# Altium project shm.PrjPcb (part 2 of 2)

## Sheet mcu_v1.SchDoc
size A2; SheetNumber: 4; SheetTotal: 4
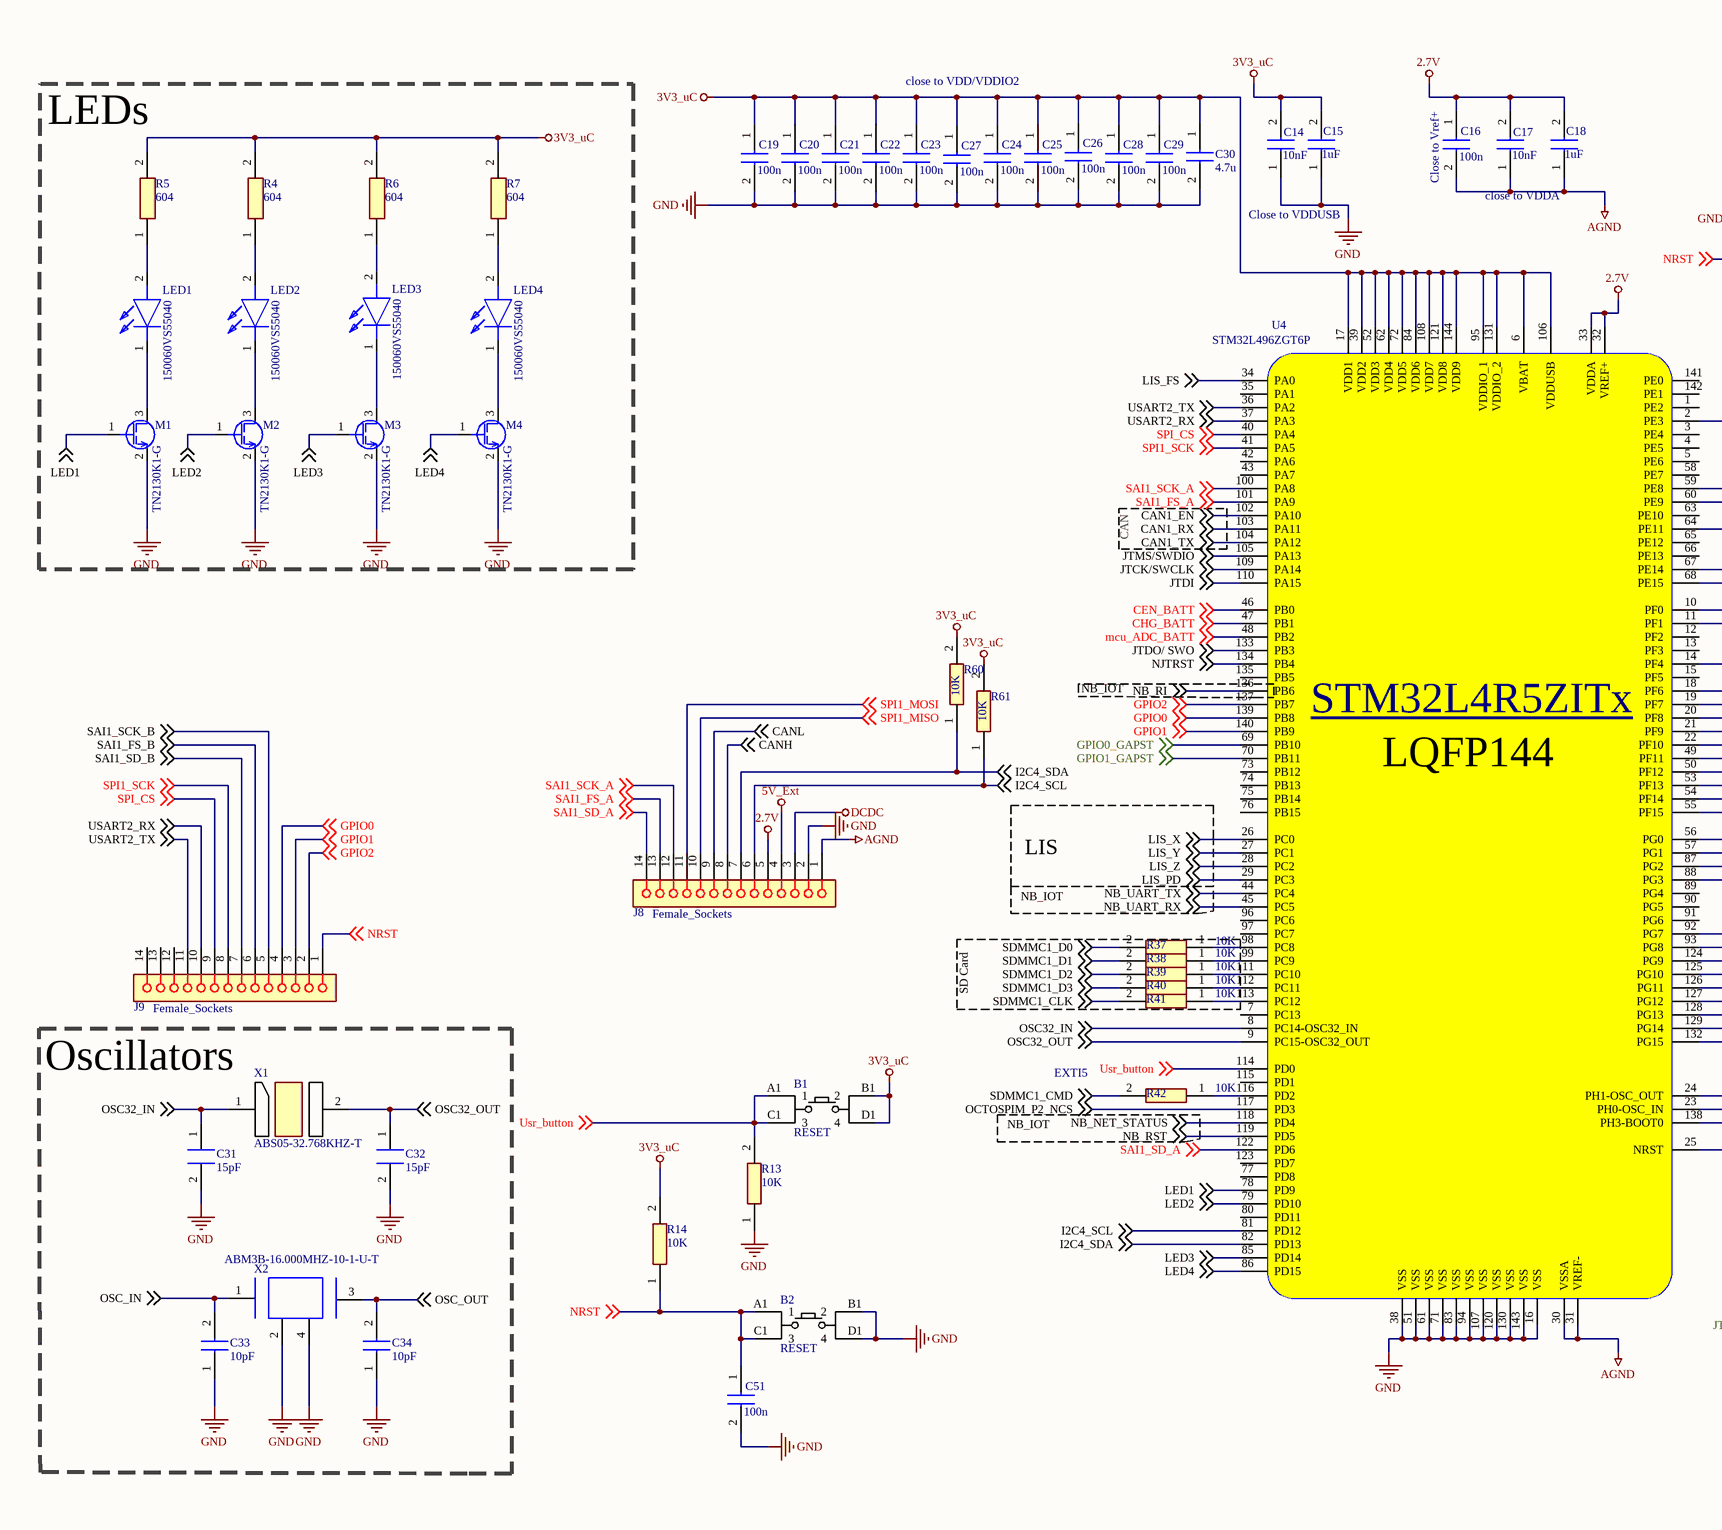
[diagram p3: mcu_v1.SchDoc, left]
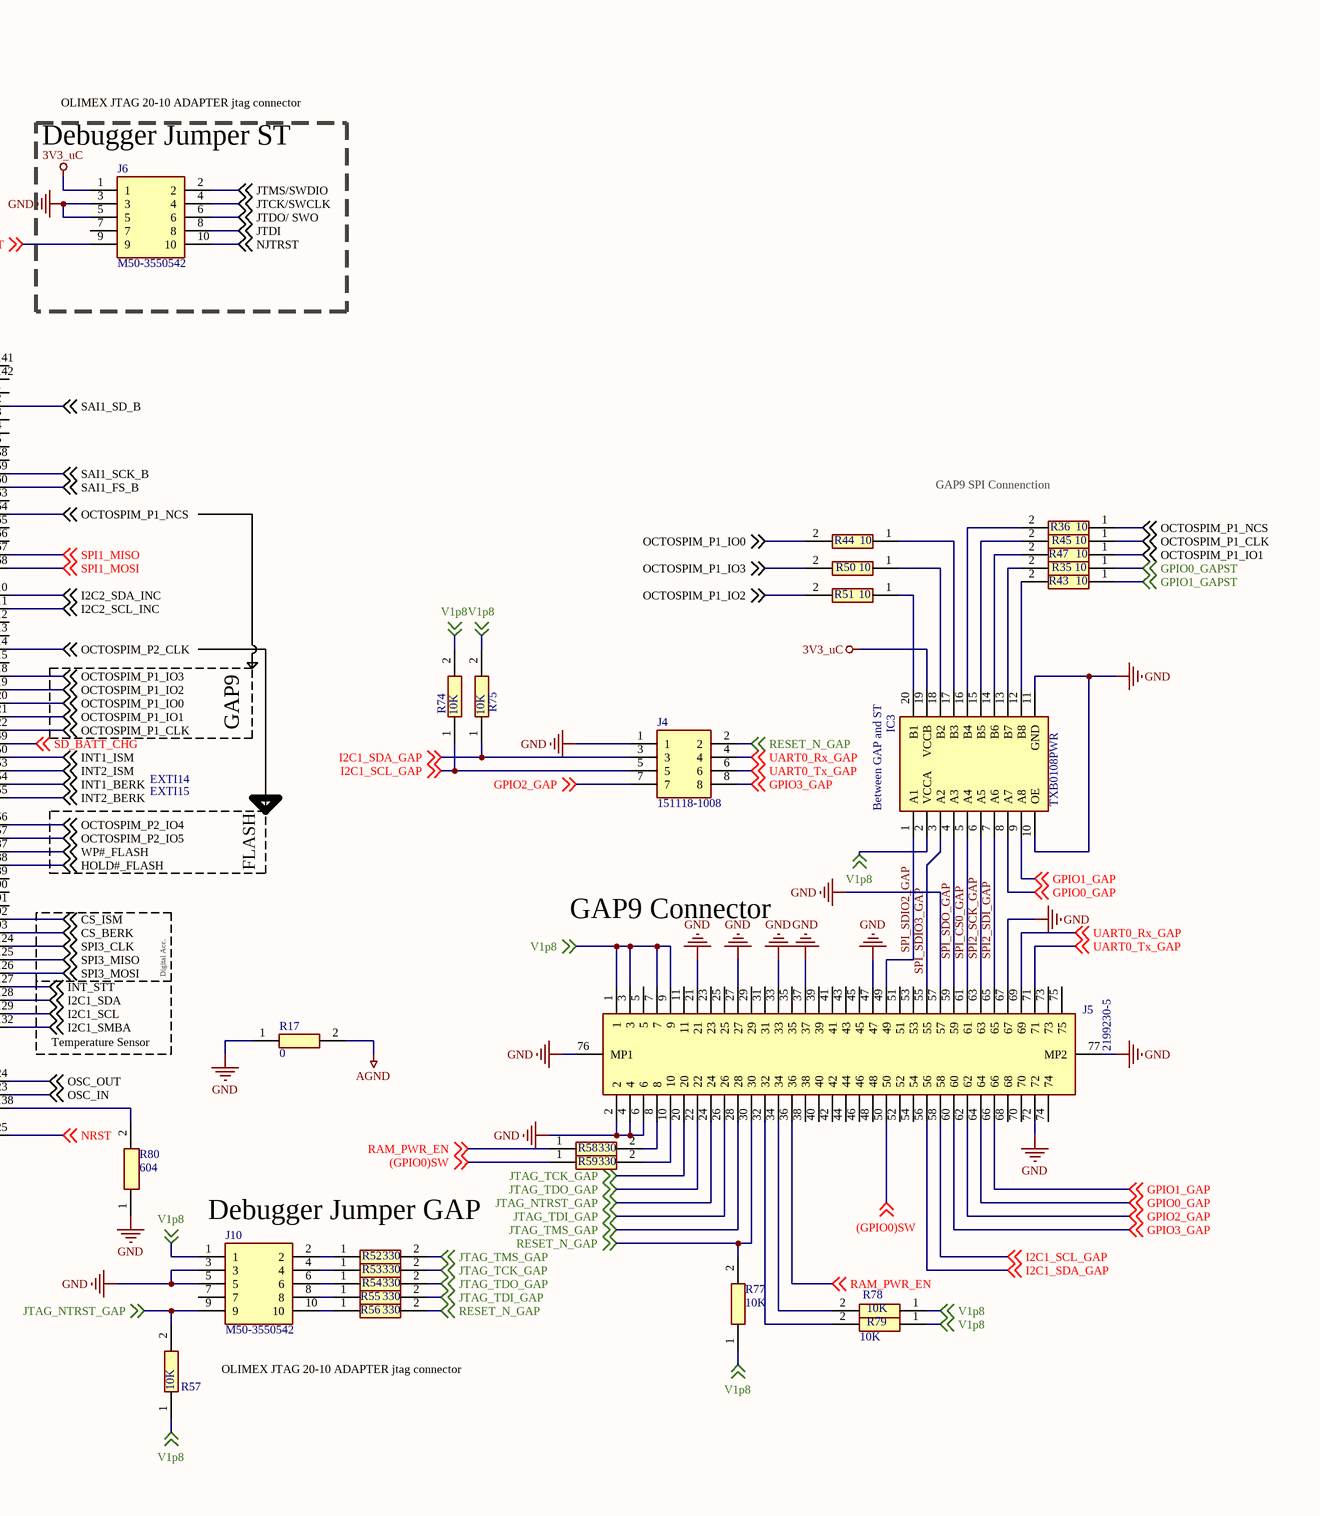
[diagram p4: mcu_v1.SchDoc, right]

### Parts
B1  RESET  [PTS645SM43JSMTR92LFS]
B2  RESET  [PTS645SM43JSMTR92LFS]
C14  10nF  [CAPC1608X87N]
C15  1uF  [CAPC2012X100N]
C16  100n  [CAPC1608X87N]
C17  10nF  [CAPC1608X87N]
C18  1uF  [CAPC2012X100N]
C19  100n  [CAPC1608X87N]
C20  100n  [CAPC1608X87N]
C21  100n  [CAPC1608X87N]
C22  100n  [CAPC1608X87N]
C23  100n  [CAPC1608X87N]
C24  100n  [CAPC1608X87N]
C25  100n  [CAPC1608X87N]
C26  100n  [CAPC1608X87N]
C27  100n  [CAPC1608X87N]
C28  100n  [CAPC1608X87N]
C29  100n  [CAPC1608X87N]
C30  4.7u  [CAPC3216X100N]
C31  15pF  [CAPC1608X87N]
C32  15pF  [CAPC1608X87N]
C33  10pF  [CAPC1608X87N]
C34  10pF  [CAPC1608X87N]
C51  100n  [CAPC1608X87N]
IC3  TXB0108PWR  [SOP65P640X120-20N]
J4  151118-1008  [1511181008]
J5  2199230-5  [21992305]
J6  M50-3550542  [SHDR10W40P127_2X5_2083X565X1160P]
J8  Female_Sockets  [BCS-114-XXX-S-TE]
J9  Female_Sockets  [BCS-114-XXX-S-TE]
J10  M50-3550542  [SHDR10W40P127_2X5_2083X565X1160P]
LED1  150060VS55040  [LEDM168X50N]
LED2  150060VS55040  [LEDM168X50N]
LED3  150060VS55040  [LEDM168X50N]
LED4  150060VS55040  [LEDM168X50N]
M1  TN2130K1-G  [SOT95P237X112-3N]
M2  TN2130K1-G  [SOT95P237X112-3N]
M3  TN2130K1-G  [SOT95P237X112-3N]
M4  TN2130K1-G  [SOT95P237X112-3N]
R4  604  [RESC1608X55N]
R5  604  [RESC1608X55N]
R6  604  [RESC1608X55N]
R7  604  [RESC1608X55N]
R13  10K  [ERJ3EK_(0603)]
R14  10K  [RESC1608X55N]
R17  0  [RESC1608X55N]
R35  10  [RESC1005X40N]
R36  10  [RESC1005X40N]
R37  10K  [ERJ3EK_(0603)]
R38  10K  [ERJ3EK_(0603)]
R39  10K  [ERJ3EK_(0603)]
R40  10K  [ERJ3EK_(0603)]
R41  10K  [ERJ3EK_(0603)]
R42  10K  [ERJ3EK_(0603)]
R43  10  [RESC1005X40N]
R44  10  [RESC1005X40N]
R45  10  [RESC1005X40N]
R47  10  [RESC1005X40N]
R50  10  [RESC1005X40N]
R51  10  [RESC1005X40N]
R52  330  [RESC3216X51N]
R53  330  [RESC3216X51N]
R54  330  [RESC3216X51N]
R55  330  [RESC3216X51N]
R56  330  [RESC3216X51N]
R57  10K  [ERJ3EK_(0603)]
R58  330  [RESC3216X51N]
R59  330  [RESC3216X51N]
R60  10K  [ERJP14_(1210)]
R61  10K  [ERJP14_(1210)]
R74  10K  [ERJ3EK_(0603)]
R75  10K  [ERJ3EK_(0603)]
R77  10K  [ERJP14_(1210)]
R78  10K  [ERJ3EK_(0603)]
R79  10K  [ERJ3EK_(0603)]
R80  604  [RESC1608X55N]
U4  STM32L496ZGT6P  [QFP50P2200X2200X160-144N]
X1  ABS05-32.768KHZ-T  [ABS0532768KHZT]
X2  ABM3B-16.000MHZ-10-1-U-T  [OSCCC500X320X110-4N]

### Blocks framed on the sheet
LEDs: LED1-LED4 M1-M4 R4-R7
Debugger Jumper ST: J6
SD Card: R37-R41
Oscillators: C31-C34 X1 X2

### Nets
2.7V: C16.1 C17.2 C18.2 J8.5 U4.32(VREF+) U4.33(VDDA)
3V3_uC: B1.B1(2) B1.D1(4) C14.2 C15.2 C19.1 C20.1 C21.1 C22.1 C23.1 C24.1 C25.1 C26.1 C27.1 C28.1 C29.1 C30.1 IC3.19(VCCB) J6.1 R4.2 R5.2 R6.2 R7.2 R14.2 R60.2 R61.2 U4.6(VBAT) U4.17(VDD1) U4.39(VDD2) U4.52(VDD3) U4.62(VDD4) U4.72(VDD5) U4.84(VDD6) U4.95(VDDIO_1) U4.106(VDDUSB) U4.108(VDD7) U4.121(VDD8) U4.131(VDDIO_2) U4.144(VDD9)
5V_Ext: J8.4
AGND: C16.2 C17.1 C18.1 J8.1 R17.2 U4.30(VSSA) U4.31(VREF-)
DCDC: J8.3
GND: B2.B1(2) B2.D1(4) C14.1 C15.1 C19.2 C20.2 C21.2 C22.2 C23.2 C24.2 C25.2 C26.2 C27.2 C28.2 C29.2 C30.2 C31.2 C32.2 C33.1 C34.1 C51.2 IC3.10(OE) IC3.11(GND) J4.1 J5.2 J5.4 J5.6 J5.21 J5.27 J5.33 J5.37 J5.47 J5.57 J5.67 J5.72 J5.76(MP1) J5.77(MP2) J6.3 J6.5 J8.2 J10.3 J10.5 M1.2(S) M2.2(S) M3.2(S) M4.2(S) R13.1 R17.1 R80.1 U4.16(VSS) U4.38(VSS) U4.51(VSS) U4.61(VSS) U4.71(VSS) U4.83(VSS) U4.94(VSS) U4.107(VSS) U4.120(VSS) U4.130(VSS) U4.143(VSS) X2.2 X2.4
(GPIO0)SW: J5.50 R59.1 ; off-sheet (GPIO0)SW
CAN1_EN: U4.102(PA10) ; off-sheet CAN1_EN
CAN1_RX: U4.103(PA11) ; off-sheet CAN1_RX
CAN1_TX: U4.104(PA12) ; off-sheet CAN1_TX
CANH: J8.8 ; off-sheet CANH
CANL: J8.9 ; off-sheet CANL
CEN_BATT: U4.46(PB0) ; off-sheet CEN_BATT
CHG_BATT: U4.47(PB1) ; off-sheet CHG_BATT
CS_BERK: U4.93(PG8) ; off-sheet CS_BERK
CS_ISM: U4.92(PG7) ; off-sheet CS_ISM
GPIO0: J9.4 U4.139(PB8) ; off-sheet GPIO0
GPIO0_GAP: IC3.8(A7) J5.64 ; off-sheet GPIO0_GAP
GPIO0_GAPST: R35.1 U4.69(PB10) ; off-sheet GPIO0_GAPST
GPIO1: J9.3 U4.140(PB9) ; off-sheet GPIO1
GPIO1_GAP: IC3.9(A8) J5.66 ; off-sheet GPIO1_GAP
GPIO1_GAPST: R43.1 U4.70(PB11) ; off-sheet GPIO1_GAPST
GPIO2: J9.2 U4.137(PB7) ; off-sheet GPIO2
GPIO2_GAP: J4.7 J5.62 ; off-sheet GPIO2_GAP
GPIO3_GAP: J4.8 J5.60 ; off-sheet GPIO3_GAP
HOLD#_FLASH: U4.88(PG3) ; off-sheet HOLD#_FLASH
I2C1_SCL: U4.129(PG14) ; off-sheet I2C1_SCL
I2C1_SCL_GAP: J4.5 J5.58 R74.1 ; off-sheet I2C1_SCL_GAP
I2C1_SDA: U4.128(PG13) ; off-sheet I2C1_SDA
I2C1_SDA_GAP: J4.3 J5.56 R75.1 ; off-sheet I2C1_SDA_GAP
I2C1_SMBA: U4.132(PG15) ; off-sheet I2C1_SMBA
I2C2_SCL_INC: U4.11(PF1) ; off-sheet I2C2_SCL_INC
I2C2_SDA_INC: U4.10(PF0) ; off-sheet I2C2_SDA_INC
I2C4_SCL: J8.6 R61.1 U4.81(PD12) ; off-sheet I2C4_SCL
I2C4_SDA: J8.7 R60.1 U4.82(PD13) ; off-sheet I2C4_SDA
INT1_BERK: U4.54(PF14) ; off-sheet INT1_BERK
INT1_ISM: U4.50(PF12) ; off-sheet INT1_ISM
INT2_BERK: U4.55(PF15) ; off-sheet INT2_BERK
INT2_ISM: U4.53(PF13) ; off-sheet INT2_ISM
INT_STT: U4.127(PG12) ; off-sheet INT_STT
JTAG_NTRST_GAP: J5.24 J10.9 R57.2 ; off-sheet JTAG_NTRST_GAP
JTAG_TCK_GAP: J5.20 R53.2 ; off-sheet JTAG_TCK_GAP
JTAG_TDI_GAP: J5.26 R55.2 ; off-sheet JTAG_TDI_GAP
JTAG_TDO_GAP: J5.22 R54.2 ; off-sheet JTAG_TDO_GAP
JTAG_TMS_GAP: J5.28 R52.2 ; off-sheet JTAG_TMS_GAP
JTCK/SWCLK: J6.4 U4.109(PA14) ; off-sheet JTCK/SWCLK
JTDI: J6.8 U4.110(PA15) ; off-sheet JTDI
JTDO/ SWO: J6.6 U4.133(PB3) ; off-sheet JTDO/ SWO
JTMS/SWDIO: J6.2 U4.105(PA13) ; off-sheet JTMS/SWDIO
LED1: M1.1(G) U4.78(PD9) ; off-sheet LED1
LED2: M2.1(G) U4.79(PD10) ; off-sheet LED2
LED3: M3.1(G) U4.85(PD14) ; off-sheet LED3
LED4: M4.1(G) U4.86(PD15) ; off-sheet LED4
LIS_FS: U4.34(PA0) ; off-sheet LIS_FS
LIS_PD: U4.29(PC3) ; off-sheet LIS_PD
LIS_X: U4.26(PC0) ; off-sheet LIS_X
LIS_Y: U4.27(PC1) ; off-sheet LIS_Y
LIS_Z: U4.28(PC2) ; off-sheet LIS_Z
mcu_ADC_BATT: U4.48(PB2) ; off-sheet mcu_ADC_BATT
NB_NET_STATUS: U4.118(PD4) ; off-sheet NB_NET_STATUS
NB_RI: U4.136(PB6) ; off-sheet NB_RI
NB_RST: U4.119(PD5) ; off-sheet NB_RST
NB_UART_RX: U4.45(PC5) ; off-sheet NB_UART_RX
NB_UART_TX: U4.44(PC4) ; off-sheet NB_UART_TX
NJTRST: J6.10 U4.134(PB4) ; off-sheet NJTRST
NRST: B2.A1(1) B2.C1(3) C51.1 J6.9 J9.1 R14.1 U4.25(NRST) ; off-sheet NRST
OCTOSPIM_P1_CLK: R45.1 U4.22(PF10) ; off-sheet OCTOSPIM_P1_CLK
OCTOSPIM_P1_IO0: R44.2 U4.20(PF8) ; off-sheet OCTOSPIM_P1_IO0
OCTOSPIM_P1_IO1: R47.1 U4.21(PF9) ; off-sheet OCTOSPIM_P1_IO1
OCTOSPIM_P1_IO2: R51.2 U4.19(PF7) ; off-sheet OCTOSPIM_P1_IO2
OCTOSPIM_P1_IO3: R50.2 U4.18(PF6) ; off-sheet OCTOSPIM_P1_IO3
OCTOSPIM_P1_NCS: R36.1 U4.64(PE11) ; off-sheet OCTOSPIM_P1_NCS
OCTOSPIM_P2_CLK: U4.14(PF4) ; off-sheet OCTOSPIM_P2_CLK
OCTOSPIM_P2_IO4: U4.56(PG0) ; off-sheet OCTOSPIM_P2_IO4
OCTOSPIM_P2_IO5: U4.57(PG1) ; off-sheet OCTOSPIM_P2_IO5
OCTOSPIM_P2_NCS: U4.117(PD3) ; off-sheet OCTOSPIM_P2_NCS
OSC32_IN: C31.1 U4.8(PC14-OSC32_IN) X1.1(In) ; off-sheet OSC32_IN
OSC32_OUT: C32.1 U4.9(PC15-OSC32_OUT) X1.2(OUT) ; off-sheet OSC32_OUT
OSC_IN: C33.2 U4.23(PH0-OSC_IN) X2.1 ; off-sheet OSC_IN
OSC_OUT: C34.2 U4.24(PH1-OSC_OUT) X2.3 ; off-sheet OSC_OUT
RAM_PWR_EN: J5.36 R58.1 ; off-sheet RAM_PWR_EN
RESET_N_GAP: J4.2 J5.30 R56.2 R77.2 ; off-sheet RESET_N_GAP
SAI1_FS_A: J8.13 U4.101(PA9) ; off-sheet SAI1_FS_A
SAI1_FS_B: J9.6 U4.60(PE9) ; off-sheet SAI1_FS_B
SAI1_SCK_A: J8.12 U4.100(PA8) ; off-sheet SAI1_SCK_A
SAI1_SCK_B: J9.5 U4.59(PE8) ; off-sheet SAI1_SCK_B
SAI1_SD_A: J8.14 U4.122(PD6) ; off-sheet SAI1_SD_A
SAI1_SD_B: J9.7 U4.2(PE3) ; off-sheet SAI1_SD_B
SD_BATT_CHG: U4.49(PF11) ; off-sheet SD_BATT_CHG
SDMMC1_CLK: R41.2 ; off-sheet SDMMC1_CLK
SDMMC1_CMD: R42.2 ; off-sheet SDMMC1_CMD
SDMMC1_D0: R37.2 ; off-sheet SDMMC1_D0
SDMMC1_D1: R38.2 ; off-sheet SDMMC1_D1
SDMMC1_D2: R39.2 ; off-sheet SDMMC1_D2
SDMMC1_D3: R40.2 ; off-sheet SDMMC1_D3
SPI1_MISO: J8.10 U4.67(PE14) ; off-sheet SPI1_MISO
SPI1_MOSI: J8.11 U4.68(PE15) ; off-sheet SPI1_MOSI
SPI1_SCK: J9.8 U4.41(PA5) ; off-sheet SPI1_SCK
SPI2_SCK_GAP: IC3.6(A5) J5.63
SPI2_SDI_GAP: IC3.7(A6) J5.65
SPI3_CLK: U4.124(PG9) ; off-sheet SPI3_CLK
SPI3_MISO: U4.125(PG10) ; off-sheet SPI3_MISO
SPI3_MOSI: U4.126(PG11) ; off-sheet SPI3_MOSI
SPI_CS: J9.9 U4.40(PA4) ; off-sheet SPI_CS
SPI_CS0_GAP: IC3.5(A4) J5.61
SPI_SDIO2_GAP: IC3.1(A1) J5.49
SPI_SDIO3_GAP: IC3.3(A2) J5.55
SPI_SDO_GAP: IC3.4(A3) J5.59
UART0_Rx_GAP: J4.4 J5.69 ; off-sheet UART0_Rx_GAP
UART0_Tx_GAP: J4.6 J5.71 ; off-sheet UART0_Tx_GAP
USART2_RX: J9.10 U4.37(PA3) ; off-sheet USART2_RX
USART2_TX: J9.11 U4.36(PA2) ; off-sheet USART2_TX
Usr_button: B1.A1(1) B1.C1(3) R13.2 U4.114(PD0) ; off-sheet Usr_button
V1p8: IC3.2(VCCA) J5.1 J5.3 J5.7 J5.9 J10.1 R57.1 R74.2 R75.2 R77.1 R78.1 R79.1 ; off-sheet V1p8
WP#_FLASH: U4.87(PG2) ; off-sheet WP#_FLASH
NetIC3_12: IC3.12(B8) R43.2
NetIC3_13: IC3.13(B7) R35.2
NetIC3_14: IC3.14(B6) R47.2
NetIC3_15: IC3.15(B5) R45.2
NetIC3_16: IC3.16(B4) R36.2
NetIC3_17: IC3.17(B3) R44.1
NetIC3_18: IC3.18(B2) R50.1
NetIC3_20: IC3.20(B1) R51.1
NetJ5_8: J5.8 R58.2
NetJ5_10: J5.10 R59.2
NetJ5_32: J5.32 R79.2
NetJ5_34: J5.34 R78.2
NetJ10_2: J10.2 R52.1
NetJ10_4: J10.4 R53.1
NetJ10_6: J10.6 R54.1
NetJ10_8: J10.8 R55.1
NetJ10_10: J10.10 R56.1
NetLED1_1: LED1.1(K) M1.3(D)
NetLED1_2: LED1.2(A) R5.1
NetLED2_1: LED2.1(K) M2.3(D)
NetLED2_2: LED2.2(A) R4.1
NetLED3_1: LED3.1(K) M3.3(D)
NetLED3_2: LED3.2(A) R6.1
NetLED4_1: LED4.1(K) M4.3(D)
NetLED4_2: LED4.2(A) R7.1
NetR37_1: R37.1 U4.98(PC8)
NetR38_1: R38.1 U4.99(PC9)
NetR39_1: R39.1 U4.111(PC10)
NetR40_1: R40.1 U4.112(PC11)
NetR41_1: R41.1 U4.113(PC12)
NetR42_1: R42.1 U4.116(PD2)
NetR80_2: R80.2 U4.138(PH3-BOOT0)

Not connected (* = marked no-connect by the designer): J5 5 11 23 25 29 31 35 38 39 40 41 42 43 44 45 46 48 51 52 53 54 68 70 73 74 75; J6 7; J9 12 13 14; J10 7; U4 1(PE2) 3(PE4) 4(PE5) 5(PE6) 7(PC13) 12(PF2) 13(PF3) 15(PF5) 35(PA1) 42(PA6) 43(PA7) 58(PE7) 63(PE10) 65(PE12) 66(PE13) 73(PB12) 74(PB13) 75(PB14) 76(PB15) 77(PD8) 80(PD11) 89(PG4) 90(PG5) 91(PG6) 96(PC6) 97(PC7) 115(PD1) 123(PD7) 135(PB5) 141(PE0) 142(PE1)

### Notes on the sheet
- close to VDD/VDDIO2
- OLIMEX JTAG 20-10 ADAPTER jtag connector
- (near C16) Close to Vref+
- Close to VDDUSB
- close to VDDA
- GAP9 SPI Connenction
- CAN
- NB_IOT
- EXTI14
- GAP9
- LIS
- EXTI15
- (near IC3) Between GAP and ST
- FLASH
- Digital Acc.
- GAP9 Connector
- Temperature Sensor
- EXTI5
- Debugger Jumper GAP
- (in symbol STM32L496ZGT6P) STM32L4R5ZITx; LQFP144

### Library data of the parts
B1 B2 = PTS645SM43JSMTR92LFS: Switch Tactile SPST N.O Round Button 12V 50mA 1.57N Solder Surface Mount T/R; Manufacturer: C&K Components; Supplier 1: Digi-Key; Supplier Part Number 1: 108-PTS645SM43JSMTR92LFSCT-ND; Manufacturer Part Number: PTS645SM43JSMTR92LFS; Stock 1: 18999; ComponentLink1URL: https://datasheet.octopart.com/PTS645SM43JSMTR92LFS-C%26K-Components-datasheet-155912617.pdf?src-supplier=Sager+Electronics; ComponentLink1Description: https://datasheet.octopart.com/PTS645SM43JSMTR92LFS-C%26K-Components-datasheet-155912617.pdf?src-supplier=Sager+Electronics; ComponentLink2URL: https://datasheet.octopart.com/PTS645SM43JSMTR92LFS-C%26K-Components-datasheet-67873720.pdf?src-supplier=Sager+Electronics; ComponentLink2Description: https://datasheet.octopart.com/PTS645SM43JSMTR92LFS-C%26K-Components-datasheet-67873720.pdf?src-supplier=Sager+Electronics; ComponentLink3URL: https://datasheet.octopart.com/PTS645SM43JSMTR92LFS-C%26K-Components-datasheet-150821959.pdf?src-supplier=Sager+Electronics; ComponentLink3Description: https://datasheet.octopart.com/PTS645SM43JSMTR92LFS-C%26K-Components-datasheet-150821959.pdf?src-supplier=Sager+Electronics
C14 C17 = 885012206014: Capacitor; Manufacturer_Name: Wurth Elektronik; Datasheet Link: https://katalog.we-online.com/pbs/datasheet/885012206014.pdf; Height: 0.87mm; Manufacturer_Part_Number: 885012206014
C15 C18 = C0805C105K4RACTU: Capacitor; Manufacturer_Name: Kemet; Datasheet Link: https://datasheet.datasheetarchive.com/originals/distributors/Datasheets-DGA10/2404873.pdf; Height: 1mm; Manufacturer_Part_Number: C0805C105K4RACTU
C16 C19-C29 C51 = 885012206071: Capacitor; Manufacturer_Name: Wurth Elektronik; Datasheet Link: https://katalog.we-online.com/pbs/datasheet/885012206071.pdf; Height: 0.87mm; Manufacturer_Part_Number: 885012206071
C30 = C1206C224J1RACAUTO: Capacitor; Manufacturer_Name: Kemet; Datasheet Link: https://connect.kemet.com:7667/gateway/IntelliData-ComponentDocumentation/1.0/download/specsheet/C1206C224J1RACAUTO; Height: 1mm; Manufacturer_Part_Number: C1206C224J1RACAUTO
C31 C32 = VJ0603A150KXJPW1BC: CAP CER 15PF 16V C0G/NP0 0603; Manufacturer: Vishay Vitramon; Dielectric Material: Tantalum; Tolerance: 10%; Dielectric: C0G; Supplier 1: Digi-Key; Supplier Part Number 1: 720-VJ0603A150KXJPW1BCCT-ND; Manufacturer Part Number: VJ0603A150KXJPW1BC; RoHS: Yes; Category: Ceramic Capacitors; Stock 1: 13534; Mount: Surface Mount; Case/Package: 0603; Case Code (Imperial): 0603; Case Code (Metric): 1608; Min Operating Temperature: -55°C; Max Operating Temperature: 125°C; Capacitance: 15pF; Voltage Rating: 16V; Voltage Rating (DC): 16V; Packaging: Tape and Reel; Package Quantity: 15000; Termination: SMD/SMT; Series: VJ W1BC; Construction: Flat; Length: 1.6mm; Width: 0.8mm; Height: 0.95mm; Depth: 0.8mm; Lead Free: Lead Free; RoHS Compliant: Yes; ComponentLink1URL: https://datasheet.ciiva.com/5423/vjw1bcbascomseries-223529-5423350.pdf?src-supplier=Mouser; ComponentLink1Description: https://datasheet.ciiva.com/5423/vjw1bcbascomseries-223529-5423350.pdf?src-supplier=Mouser; ComponentLink2URL: https://datasheet.ciiva.com/16503/vjw1bcbascomseries-16503578.pdf?src-supplier=Future+Electronics; ComponentLink2Description: https://datasheet.ciiva.com/16503/vjw1bcbascomseries-16503578.pdf?src-supplier=Future+Electronics
C33 C34 = C0603C100K4GACTU: Capacitor; Manufacturer_Name: Kemet; Datasheet Link: https://componentsearchengine.com//C0603C100K4GACTU.pdf; Height: 0.87mm; Mouser2 Part Number: 80-C0603C100K4GACTU; Mouser2 Price/Stock: https://www.mouser.com/Search/Refine.aspx?Keyword=80-C0603C100K4GACTU; Manufacturer_Part_Number: C0603C100K4GACTU
IC3 = TXB0108PWR: Integrated Circuit; Manufacturer_Name: Texas Instruments; Datasheet Link: http://www.ti.com/lit/ds/symlink/txb0108.pdf; Height: 1.2mm; Mouser2 Part Number: 595-TXB0108PWR; Mouser2 Price/Stock: https://www.mouser.com/Search/Refine.aspx?Keyword=595-TXB0108PWR; Manufacturer_Part_Number: TXB0108PWR
J4 = 151118-1008: Connector; Manufacturer_Name: Molex; Height: 6.6mm; Manufacturer_Part_Number: 151118-1008
J5 = 2199230-5: Connector; Manufacturer_Name: TE Connectivity; Datasheet Link: https://componentsearchengine.com//2199230-5.pdf; Height: 4.2mm; Mouser2 Part Number: 571-2199230-5; Mouser2 Price/Stock: https://www.mouser.com/Search/Refine.aspx?Keyword=571-2199230-5; Manufacturer_Part_Number: 2199230-5
J6 J10 = M50-3550542: Connector; Manufacturer_Name: Harwin; Datasheet Link: https://componentsearchengine.com/Datasheets/2/M50-3550542.pdf; Height: 11.6mm; Manufacturer_Part_Number: M50-3550542
J8 J9 = BCS-114-L-S-TE: Conn Socket Strip SKT 14 POS 2.54mm Solder ST Top Entry Thru-Hole TIGER CLAW™ Tube; Manufacturer: Samtec; Contact Resistance: 10mR; Max Current Rating: 5.9A; Voltage Rating: 475V; Connector Type: Receptacle; Number of Positions: 14; Supplier 1: RSComponents; Supplier Part Number 1: 7666525; Manufacturer Part Number: BCS-114-L-S-TE; RoHS: Yes; Category: Connectors; Stock 1: 1; Mount: Through Hole; Contact Material: Bronze; Contact Plating: Gold; Color: Black; Housing Color: Black; Housing Material: Polymer; Min Operating Temperature: -55°C; Max Operating Temperature: 125°C; Number of Rows: 1; Packaging: Bulk; Package Quantity: 1; Termination: Solder; Max Voltage Rating (AC): 475V; Number of Contacts: 14; Gender: Receptacle; Orientation: Vertical; Series: Tiger Claw™ BCS; Length: 35.56mm; Pitch: 2.54mm; Depth: 2.54mm; Radiation Hardening: No; REACH SVHC: No SVHC; Lead Free: Lead Free; RoHS Compliant: Yes; ComponentLink1URL: https://datasheet.ciiva.com/25617/0900766b8115c15c-25617469.pdf?src-supplier=RSComponents; ComponentLink1Description: https://datasheet.ciiva.com/25617/0900766b8115c15c-25617469.pdf?src-supplier=RSComponents; ComponentLink2URL: https://datasheet.ciiva.com/413/bcs-1xx-xxx-x-xx-xxx-mkt-413700.pdf?src-supplier=Digi-Key; ComponentLink2Description: https://datasheet.ciiva.com/413/bcs-1xx-xxx-x-xx-xxx-mkt-413700.pdf?src-supplier=Digi-Key; ComponentLink3URL: https://datasheet.ciiva.com/10044/bcs-10044566.pdf?src-supplier=Avnet; ComponentLink3Description: https://datasheet.ciiva.com/10044/bcs-10044566.pdf?src-supplier=Avnet; ComponentLink4URL: https://datasheet.ciiva.com/7997/81213-7997401.pdf?src-supplier=Element14; ComponentLink4Description: https://datasheet.ciiva.com/7997/81213-7997401.pdf?src-supplier=Element14
LED1-LED4 = 150060VS55040: LED; Manufacturer_Name: Wurth Elektronik; Datasheet Link: https://katalog.we-online.com/led/datasheet/150060VS55040.pdf; Height: 0.5mm; Manufacturer_Part_Number: 150060VS55040
M1-M4 = TN2130K1-G: Mosfet, N-Channel Enhancement-Mode, 300V, 25 Ohm Rohs Compliant: Yes; Manufacturer: Microchip Supertex; Rise Time: 7ns; Continuous Drain Current (ID): 85mA; Power Dissipation: 360mW; Drain to Source Resistance: 25R; Turn-Off Delay Time: 12ns; Number of Elements: 1; Gate to Source Voltage (Vgs): 20V; Element Configuration: Single; Supplier 1: Digi-Key; Supplier Part Number 1: TN2130K1-GCT-ND; Manufacturer Part Number: TN2130K1-G; RoHS: Yes; Category: MOSFETs; Stock 1: 1445; Mount: Surface Mount; Case/Package: SOT-23; Number of Pins: 3; Min Operating Temperature: -55°C; Max Operating Temperature: 150°C; Package Quantity: 3000; Packaging: Tape and Reel; Drain to Source Breakdown Voltage: 300V; Fall Time: 7ns; Radiation Hardening: No; Lead Free: Lead Free; ComponentLink1URL: https://datasheet.ciiva.com/30232/616tn2130-30232358.pdf?src-supplier=Onlinecomponents.com; ComponentLink1Description: https://datasheet.ciiva.com/30232/616tn2130-30232358.pdf?src-supplier=Onlinecomponents.com; ComponentLink2URL: https://datasheet.ciiva.com/16232/tn2130-16232280.pdf?src-supplier=Onlinecomponents.com; ComponentLink2Description: https://datasheet.ciiva.com/16232/tn2130-16232280.pdf?src-supplier=Onlinecomponents.com
R4-R7 R80 = RT0603FRE07604RL: Res Thin Film 0603 604 Ohm 1% 1/10W ±50ppm/°C Molded SMD SMD Paper T/R; Manufacturer: Yageo; Voltage Rating: 75V; Resistance: 604R; Power Rating: 100mW; Voltage Rating (DC): 50V; Supplier 1: Digi-Key; Supplier Part Number 1: 13-RT0603FRE07604RLCT-ND; Manufacturer Part Number: RT0603FRE07604RL; RoHS: Yes; Category: Chip SMD Resistors; Stock 1: 6284; Case/Package: 0603; Case Code (Metric): 1608; Case Code (Imperial): 0603; Contact Plating: Tin,Matte; Min Operating Temperature: -55°C; Max Operating Temperature: 125°C; Tolerance: 1%; Packaging: Tape and Reel; Package Quantity: 5000; Resistor Type: Thin Film; Termination: SMD/SMT; Number of Terminations: 2; Temperature Coefficient: 50ppm/°C; Max Power Dissipation: 100mW; Series: RT; Construction: Rectangular; Length: 0.063inch; Width: 0.031inch; Height: 0.022inch; Depth: 0.8mm; Radiation Hardening: No; Military Standard: Not; Lead Free: Lead Free; RoHS Compliant: Yes; ComponentLink1URL: https://datasheet.ciiva.com/2559/pyu-rt-1-to-0-05-rohs-l-5-2559885.pdf?src-supplier=Digi-Key; ComponentLink1Description: https://datasheet.ciiva.com/2559/pyu-rt-1-to-0-05-rohs-l-5-2559885.pdf?src-supplier=Digi-Key; ComponentLink2URL: https://datasheet.ciiva.com/8885/pyu-rt-1-to-0-05-rohs-l-4-8885229.pdf?src-supplier=Avnet; ComponentLink2Description: https://datasheet.ciiva.com/8885/pyu-rt-1-to-0-05-rohs-l-4-8885229.pdf?src-supplier=Avnet
R13 R14 R37-R42 R57 R74 R75 R78 R79 = ERJ-3EKF1002V: Resistor; Manufacturer_Name: Panasonic; Datasheet Link: https://componentsearchengine.com//ERJ-3EKF1002V.pdf; Height: 0.55mm; Mouser2 Part Number: 667-ERJ-3EKF1002V; Mouser2 Price/Stock: https://www.mouser.com/Search/Refine.aspx?Keyword=667-ERJ-3EKF1002V; Manufacturer_Part_Number: ERJ-3EKF1002V
R17 = RC0603FR-070RL: Resistor; Manufacturer_Name: YAGEO (PHYCOMP); Height: 0.55mm; Manufacturer_Part_Number: RC0603FR-070RL
R35 R36 R43-R45 R47 R50 R51 = CR0402-FX-10R0GLF: Resistor; Manufacturer_Name: Bourns; Datasheet Link: https://www.bourns.com/pdfs/CR0402.pdf; Height: 0.4mm; Manufacturer_Part_Number: CR0402-FX-10R0GLF
R52-R56 R58 R59 = PHPA1206E3300BST1: Resistor; Manufacturer_Name: Vishay; Datasheet Link: https://www.vishay.com/docs/60160/phpa.pdf; Height: 0.508mm; Manufacturer_Part_Number: PHPA1206E3300BST1
R60 R61 R77 = ERJ-P14J103U: Resistor; Manufacturer_Name: Panasonic; Datasheet Link: http://industrial.panasonic.com/cdbs/www-data/pdf/RDO0000/AOA0000C331.pdf; Height: 0.7mm; Manufacturer_Part_Number: ERJ-P14J103U
U4 = STM32L496ZGT6P: Ultra-low-power with FPU ARM Cortex-M4 MCU 80 MHz with 1 Mbyte Flash, USB OTG, LCD, DFSDM; Manufacturer: STMicroelectronics; Interface: I2C,SPI,USB,IrDA,MMC,SD,UART,USART,EBI/EMI; Peripherals: Brown-out Detect/Reset,PWM,WDT,DMA,LCD; Frequency: 80MHz; Number of I/Os: 115; Memory Size: 1MB; Oscillator Type: Internal; Supplier 1: Digi-Key; Supplier Part Number 1: 497-17999-ND; Manufacturer Part Number: STM32L496ZGT6P; RoHS: Yes; Category: Microcontrollers; Case/Package: LQFP; Min Operating Temperature: -40°C; Max Operating Temperature: 85°C; Memory Type: FLASH; Packaging: Tray; Core Architecture: ARM; ComponentLink1URL: http://www.farnell.com/datasheets/2602789.pdf?src-supplier=Farnell; ComponentLink1Description: http://www.farnell.com/datasheets/2602789.pdf?src-supplier=Farnell; ComponentLink2URL: http://www.st.com/content/ccc/resource/technical/document/datasheet/group3/3f/73/19/d1/d4/9e/48/34/DM00284211/files/DM00284211.pdf/jcr:content/translations/en.DM00284211.pdf?src-supplier=Digi-Key; ComponentLink2Description: http://www.st.com/content/ccc/resource/technical/document/datasheet/group3/3f/73/19/d1/d4/9e/48/34/DM00284211/files/DM00284211.pdf/jcr:content/translations/en.DM00284211.pdf?src-supplier=Digi-Key; ComponentLink3URL: http://www.farnell.com/datasheets/2602789.pdf?src-supplier=Newark; ComponentLink3Description: http://www.farnell.com/datasheets/2602789.pdf?src-supplier=Newark
X1 = ABS05-32.768KHZ-T: ABRACON - ABS05-32.768KHZ-T - Crystal, 32.768 kHz, SMD, 1.6mm x 1mm, 12.5 pF, 20 ppm, ABS05 Series; Frequency Tolerance: 20ppm; Load Capacitance: 12.5pF; ESR (Equivalent Series Resistance): 90kR; Supplier 1: Digi-Key; Supplier Part Number 1: 535-11899-1-ND; Manufacturer: Abracon; Manufacturer Part Number: ABS05-32.768KHZ-T; RoHS: Yes; Category: Crystals; Stock 1: 333; Mount: Surface Mount; Case/Package: SMD/SMT; Number of Pins: 2; Min Operating Temperature: -40°C; Max Operating Temperature: 85°C; Packaging: Tape and Reel; Package Quantity: 3000; Frequency: 32.768kHz; Tolerance: 20ppm; Termination: SMD/SMT; Series Resistance: 90kR; Series: ABS05; Operating Frequency: 32.768 kHz; Length: 1.6mm; Width: 0.039inch; Height: 0.02inch; Depth: 1mm; Radiation Hardening: No; REACH SVHC: No SVHC; Lead Free: Lead Free; RoHS Compliant: Yes; ComponentLink1URL: https://datasheet.ciiva.com/23810/abs05-23810480.pdf?src-supplier=Newark; ComponentLink1Description: https://datasheet.ciiva.com/23810/abs05-23810480.pdf?src-supplier=Newark; ComponentLink2URL: https://datasheet.ciiva.com/6728/abs05-6728949.pdf?src-supplier=Digi-Key; ComponentLink2Description: https://datasheet.ciiva.com/6728/abs05-6728949.pdf?src-supplier=Digi-Key; ComponentLink3URL: https://datasheet.ciiva.com/6728/abs05-6728950.pdf?src-supplier=Digi-Key; ComponentLink3Description: https://datasheet.ciiva.com/6728/abs05-6728950.pdf?src-supplier=Digi-Key; ComponentLink4URL: https://datasheet.ciiva.com/16411/abs05-16411149.pdf?src-supplier=Future+Electronics; ComponentLink4Description: https://datasheet.ciiva.com/16411/abs05-16411149.pdf?src-supplier=Future+Electronics
X2 = ABM3B-16.000MHZ-10-1-U-T: Crystal, Ceramic, 16.000Mhz, 10Pf, 10Ppm-10+60C, 5 X 3.2 X 1 Rohs Compliant: Yes; Manufacturer: Abracon; Frequency: 16MHz; ESR (Equivalent Series Resistance): 50R; Tolerance: 10ppm; Supplier 1: Digi-Key; Supplier Part Number 1: 300-8206-1-ND; Manufacturer Part Number: ABM3B-16.000MHZ-10-1-U-T; RoHS: Yes; Category: Crystals; Mount: Surface Mount; Case/Package: CSMD; Number of Pins: 4; Min Operating Temperature: -10°C; Max Operating Temperature: 60°C; Load Capacitance: 10pF; Package Quantity: 1000; Packaging: Tape and Reel; Frequency Tolerance: 10ppm; Frequency Stability: 10ppm; Termination: SMD/SMT; Resistor Type: Ceramic; Series Resistance: 50R; Length: 5mm; Width: 3.2mm; Height: 0.043inch; Depth: 3.2mm; REACH SVHC: No SVHC; Lead Free: Lead Free; ComponentLink1URL: https://datasheet.ciiva.com/15116/getdatasheetpartid-724423-15116862.pdf?src-supplier=Verical; ComponentLink1Description: https://datasheet.ciiva.com/15116/getdatasheetpartid-724423-15116862.pdf?src-supplier=Verical; ComponentLink2URL: https://datasheet.ciiva.com/16366/abm3b-16366326.pdf?src-supplier=Future+Electronics; ComponentLink2Description: https://datasheet.ciiva.com/16366/abm3b-16366326.pdf?src-supplier=Future+Electronics; ComponentLink3URL: https://datasheet.ciiva.com/862/abm3b-862456.pdf?src-supplier=Digi-Key; ComponentLink3Description: https://datasheet.ciiva.com/862/abm3b-862456.pdf?src-supplier=Digi-Key; ComponentLink4URL: https://datasheet.ciiva.com/3175/abm3b-3175821.pdf?src-supplier=Avnet; ComponentLink4Description: https://datasheet.ciiva.com/3175/abm3b-3175821.pdf?src-supplier=Avnet; ComponentLink5URL: https://datasheet.ciiva.com/862/abm3b-862455.pdf?src-supplier=Digi-Key; ComponentLink5Description: https://datasheet.ciiva.com/862/abm3b-862455.pdf?src-supplier=Digi-Key; ComponentLink6URL: https://datasheet.ciiva.com/862/abm3b-862457.pdf?src-supplier=Digi-Key; ComponentLink6Description: https://datasheet.ciiva.com/862/abm3b-862457.pdf?src-supplier=Digi-Key

## Nets that join several sheets
2.7V: new power management (C54.2 R27.2 U15.1), mcu_v1 (6 pins)
3V3_BC95: connectors (7 pins), new power management (J1.8)
3V3_sdCard: connectors (C36.1 J2.4), new power management (J1.2)
3V3_sensors: mems (13 pins), new power management (J1.4)
3V3_uC: connectors (9 pins), new power management (J1.6), mcu_v1 (38 pins)
5V_Ext: new power management (J7.1 R25.1), mcu_v1 (J8.4)
AGND: new power management (C54.1 R28.1), mcu_v1 (7 pins)
DCDC: new power management (10 pins), mcu_v1 (J8.3)
GND: mems (21 pins), connectors (53 pins), new power management (27 pins), mcu_v1 (62 pins)
CAN1_EN: connectors (IC1.8 R46.2), mcu_v1 (U4.102)
CAN1_RX: connectors (IC1.4), mcu_v1 (U4.103)
CAN1_TX: connectors (IC1.1), mcu_v1 (U4.104)
CANH: connectors (D1.1 IC1.7 R8.2), mcu_v1 (J8.8)
CANL: connectors (D1.2 IC1.6 R8.1), mcu_v1 (J8.9)
CEN_BATT: new power management (PS1.6), mcu_v1 (U4.46)
CHG_BATT: new power management (LED5.1 PS1.5), mcu_v1 (U4.47)
CS_BERK: mems (R62.1), mcu_v1 (U4.93)
CS_ISM: mems (U10.12), mcu_v1 (U4.92)
HOLD#_FLASH: connectors (U9.7), mcu_v1 (U4.88)
I2C1_SCL: mems (R19.1 U3.1), mcu_v1 (U4.129)
I2C1_SDA: mems (R12.1 U3.6), mcu_v1 (U4.128)
I2C1_SMBA: mems (R11.1 U3.4), mcu_v1 (U4.132)
I2C2_SCL_INC: mems (R68.2 R72.1), mcu_v1 (U4.11)
I2C2_SDA_INC: mems (R69.2 R71.1), mcu_v1 (U4.10)
INT1_BERK: mems (U2.6), mcu_v1 (U4.54)
INT1_ISM: mems (U10.9), mcu_v1 (U4.50)
INT2_BERK: mems (U2.4), mcu_v1 (U4.55)
INT2_ISM: mems (U10.4), mcu_v1 (U4.53)
INT_STT: mems (R9.1 U3.2), mcu_v1 (U4.127)
LIS_FS: mems (R2.1 U1.1), mcu_v1 (U4.34)
LIS_PD: mems (U1.5), mcu_v1 (U4.29)
LIS_X: mems (C5.1 U1.12), mcu_v1 (U4.26)
LIS_Y: mems (C4.1 U1.10), mcu_v1 (U4.27)
LIS_Z: mems (C3.1 U1.8), mcu_v1 (U4.28)
mcu_ADC_BATT: new power management (R30.1 R31.2), mcu_v1 (U4.48)
NB_NET_STATUS: connectors (Q5.3 R63.1), mcu_v1 (U4.118)
NB_RI: connectors (R16.2), mcu_v1 (U4.136)
NB_RST: connectors (Q9.1), mcu_v1 (U4.119)
NB_UART_RX: connectors (R10.2), mcu_v1 (U4.45)
NB_UART_TX: connectors (R15.2), mcu_v1 (U4.44)
OCTOSPIM_P2_CLK: connectors (U9.6), mcu_v1 (U4.14)
OCTOSPIM_P2_IO4: connectors (U9.5), mcu_v1 (U4.56)
OCTOSPIM_P2_IO5: connectors (U9.2), mcu_v1 (U4.57)
OCTOSPIM_P2_NCS: connectors (U9.1), mcu_v1 (U4.117)
SD_BATT_CHG: new power management (PS1.4), mcu_v1 (U4.49)
SDMMC1_CLK: connectors (J2.5), mcu_v1 (R41.2)
SDMMC1_CMD: connectors (J2.3), mcu_v1 (R42.2)
SDMMC1_D0: connectors (J2.7), mcu_v1 (R37.2)
SDMMC1_D1: connectors (J2.8), mcu_v1 (R38.2)
SDMMC1_D2: connectors (J2.1), mcu_v1 (R39.2)
SDMMC1_D3: connectors (J2.2), mcu_v1 (R40.2)
SPI3_CLK: mems (R64.1 U10.13), mcu_v1 (U4.124)
SPI3_MISO: mems (R66.1 U10.1), mcu_v1 (U4.125)
SPI3_MOSI: mems (R65.1 U10.14), mcu_v1 (U4.126)
V1p8: new power management (C53.2 L4.2 R26.2 U14.E3), mcu_v1 (12 pins)
WP#_FLASH: connectors (U9.3), mcu_v1 (U4.87)